# Altium project cmanager.PrjPCB
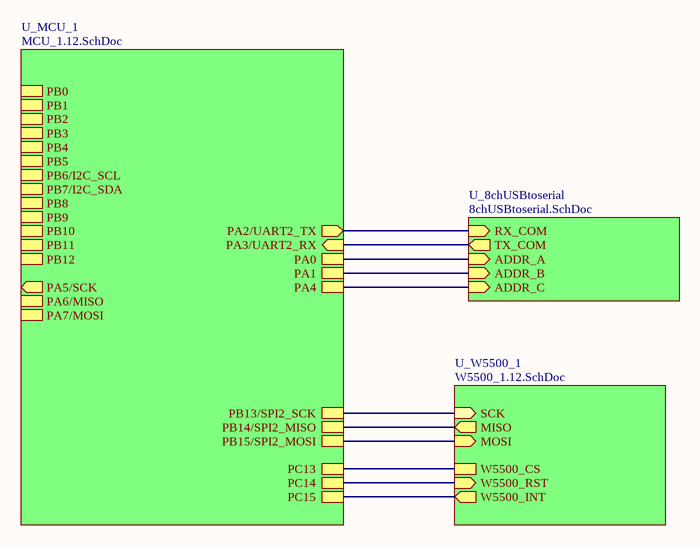
[diagram p0: main.SchDoc]
4 sheets, 114 parts. Net scope: hierarchical (ports join the sheet entries above them; power ports are global).
Board file: PCB1.PcbDoc
Sheets:
  main.SchDoc
    U_8chUSBtoserial = 8chUSBtoserial.SchDoc
    U_MCU_1 = MCU_1.12.SchDoc
    U_W5500_1 = W5500_1.12.SchDoc

## Sheet main.SchDoc
size A4

### Sub-sheets
U_8chUSBtoserial = 8chUSBtoserial.SchDoc: RX_COM (in), ADDR_A (in), ADDR_B (in), ADDR_C (in), TX_COM (out)
U_MCU_1 = MCU_1.12.SchDoc: PA7/MOSI, PA6/MISO, PA5/SCK (out), PB0, PB1, PB2, PB3, PB4, PB5, PB6/I2C_SCL, PB7/I2C_SDA, PB8, PB9, PB10, PB11, PB12, PB13/SPI2_SCK, PB14/SPI2_MISO, PB15/SPI2_MOSI, PA0, PA1, PA4, PC13, PC14, PC15, PA2/UART2_TX (out), PA3/UART2_RX (in)
U_W5500_1 = W5500_1.12.SchDoc: SCK (in), W5500_INT (out), W5500_CS, W5500_RST (in), MOSI (in), MISO (out)

### Nets
PA0: sheet U_8chUSBtoserial/ADDR_A, sheet U_MCU_1/PA0
PA1: sheet U_8chUSBtoserial/ADDR_B, sheet U_MCU_1/PA1
PA2: sheet U_8chUSBtoserial/RX_COM, sheet U_MCU_1/PA2/UART2_TX
PA3: sheet U_8chUSBtoserial/TX_COM, sheet U_MCU_1/PA3/UART2_RX
PA4: sheet U_8chUSBtoserial/ADDR_C, sheet U_MCU_1/PA4
PB13: sheet U_MCU_1/PB13/SPI2_SCK, sheet U_W5500_1/SCK
PB14: sheet U_MCU_1/PB14/SPI2_MISO, sheet U_W5500_1/MISO
PB15: sheet U_MCU_1/PB15/SPI2_MOSI, sheet U_W5500_1/MOSI
PC13: sheet U_MCU_1/PC13, sheet U_W5500_1/W5500_CS
PC14: sheet U_MCU_1/PC14, sheet U_W5500_1/W5500_RST
PC15: sheet U_MCU_1/PC15, sheet U_W5500_1/W5500_INT

## Sheet 8chUSBtoserial.SchDoc
size A3
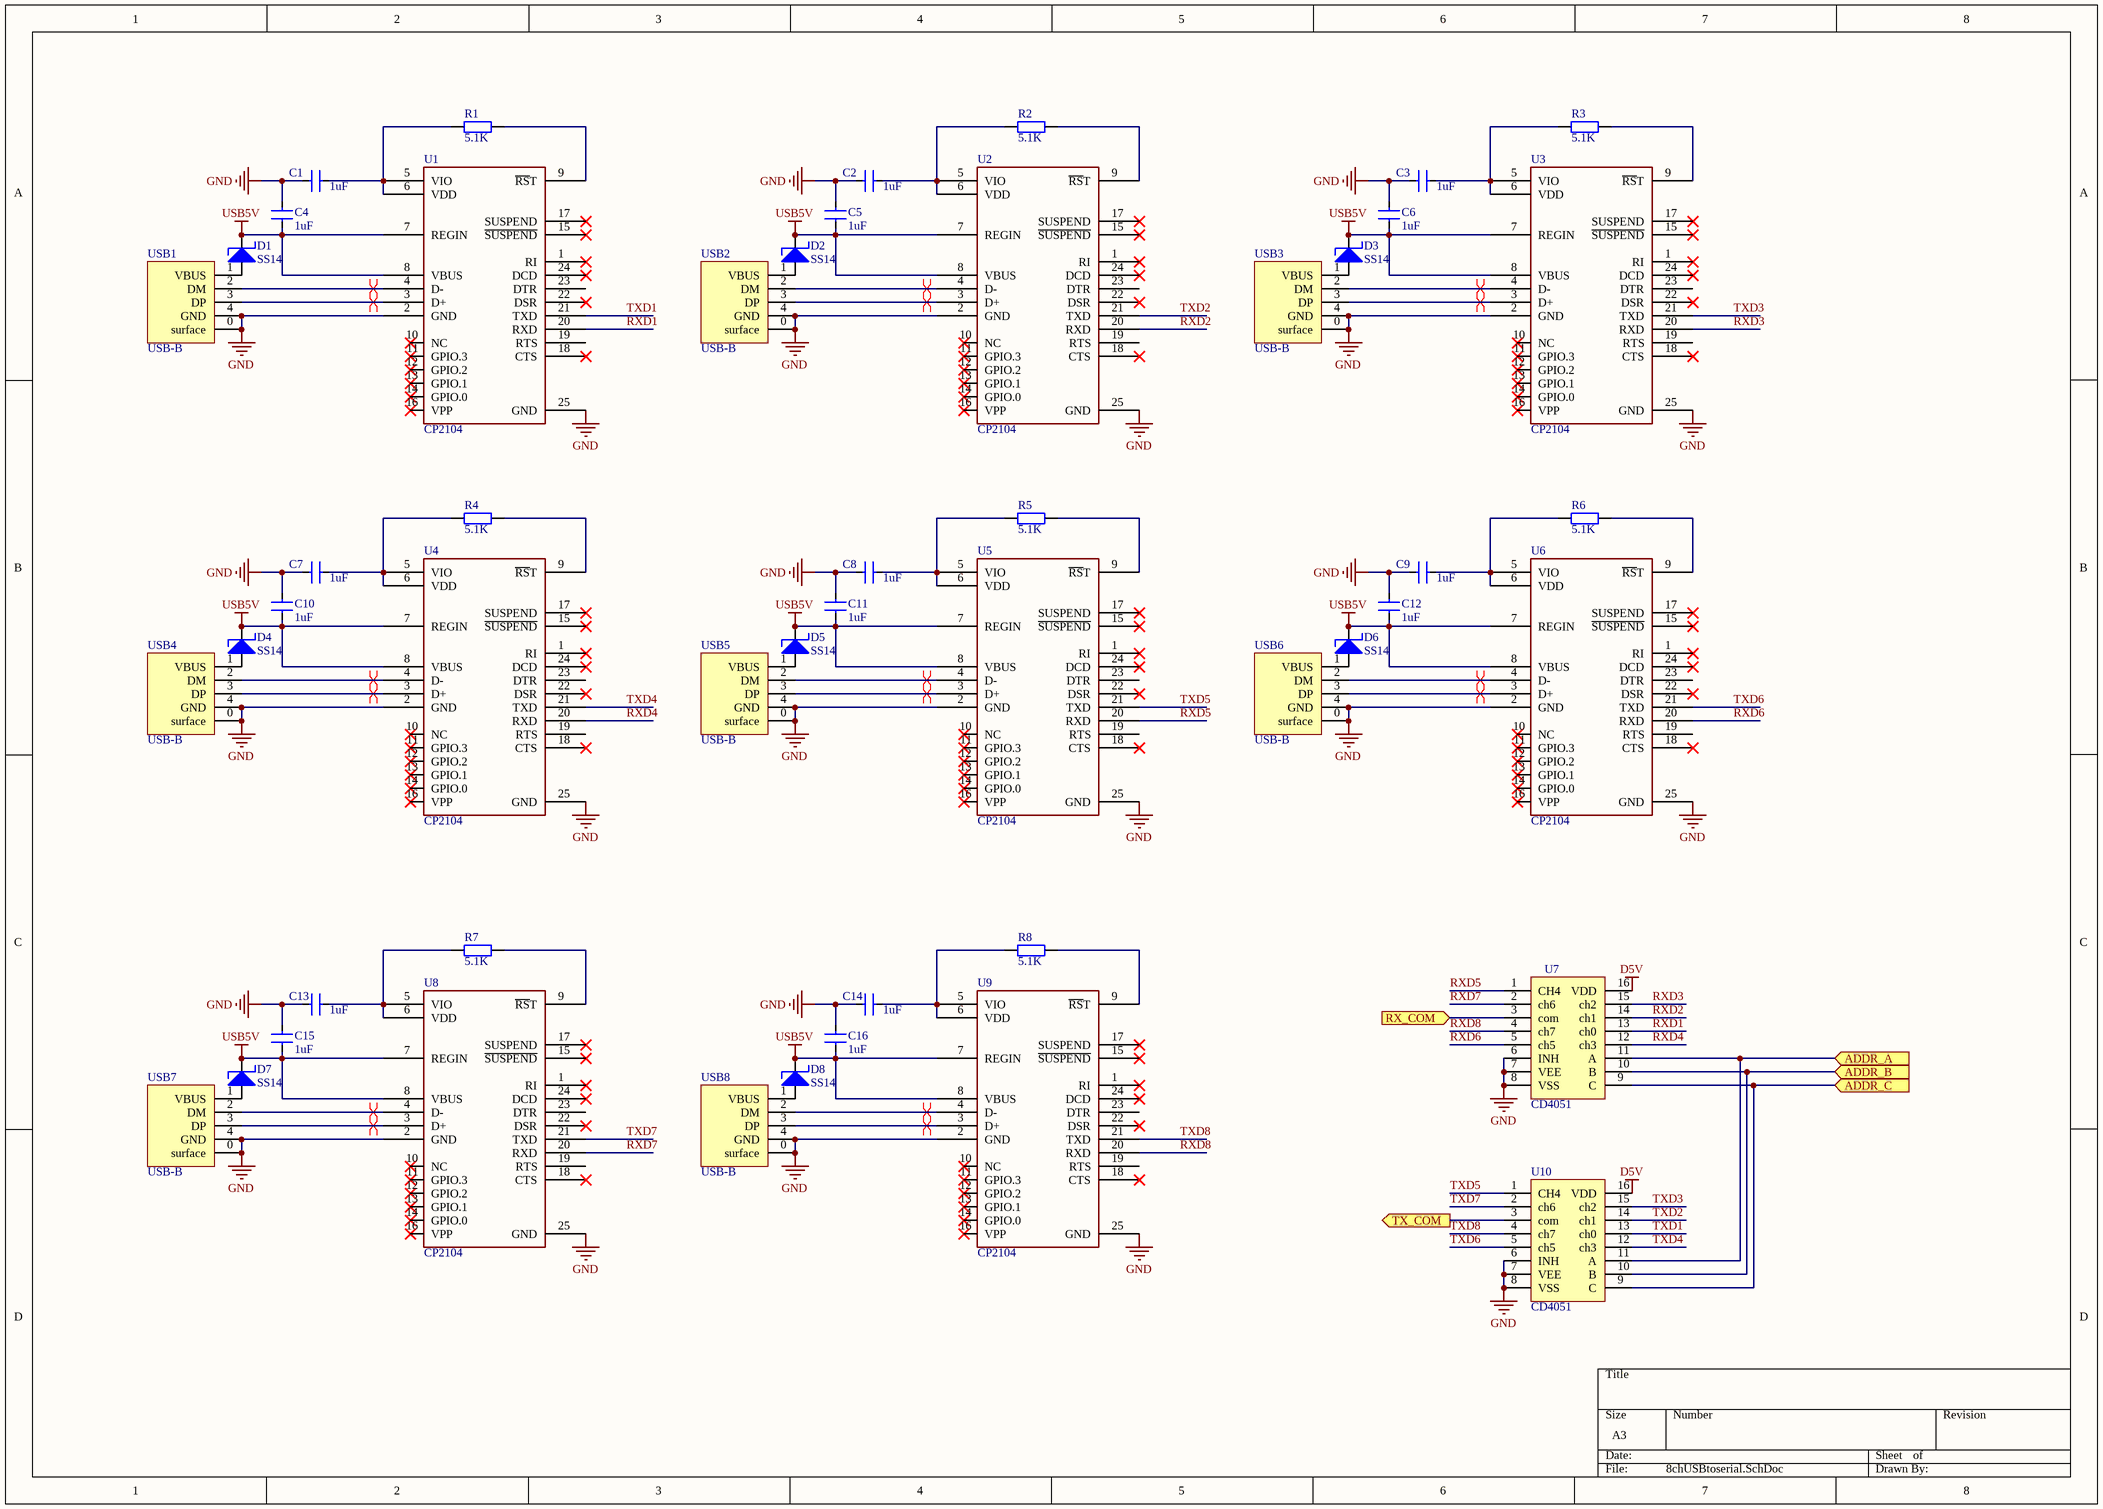
[diagram p1: 8chUSBtoserial.SchDoc]

### Parts
C1  1uF  [0603C]
C2  1uF  [0603C]
C3  1uF  [0603C]
C4  1uF  [0603C]
C5  1uF  [0603C]
C6  1uF  [0603C]
C7  1uF  [0603C]
C8  1uF  [0603C]
C9  1uF  [0603C]
C10  1uF  [0603C]
C11  1uF  [0603C]
C12  1uF  [0603C]
C13  1uF  [0603C]
C14  1uF  [0603C]
C15  1uF  [0603C]
C16  1uF  [0603C]
D1  SS14  [SOD123]
D2  SS14  [SOD123]
D3  SS14  [SOD123]
D4  SS14  [SOD123]
D5  SS14  [SOD123]
D6  SS14  [SOD123]
D7  SS14  [SOD123]
D8  SS14  [SOD123]
R1  5.1K  [0603R]
R2  5.1K  [0603R]
R3  5.1K  [0603R]
R4  5.1K  [0603R]
R5  5.1K  [0603R]
R6  5.1K  [0603R]
R7  5.1K  [0603R]
R8  5.1K  [0603R]
U1  CP2104  [QFN24]
U2  CP2104  [QFN24]
U3  CP2104  [QFN24]
U4  CP2104  [QFN24]
U5  CP2104  [QFN24]
U6  CP2104  [QFN24]
U7  CD4051  [SOP16]
U8  CP2104  [QFN24]
U9  CP2104  [QFN24]
U10  CD4051  [SOP16]
USB1  USB-B  [USB-B]
USB2  USB-B  [USB-B]
USB3  USB-B  [USB-B]
USB4  USB-B  [USB-B]
USB5  USB-B  [USB-B]
USB6  USB-B  [USB-B]
USB7  USB-B  [USB-B]
USB8  USB-B  [USB-B]

### Ports
ADDR_A (in), ADDR_B (in), ADDR_C (in), RX_COM (in), TX_COM (out)

### Nets
D5V: C4.2 C5.2 C6.2 C10.2 C11.2 C12.2 C15.2 C16.2 D1.K D2.K D3.K D4.K D5.K D6.K D7.K D8.K U1.7(REGIN) U1.8(VBUS) U2.7(REGIN) U2.8(VBUS) U3.7(REGIN) U3.8(VBUS) U4.7(REGIN) U4.8(VBUS) U5.7(REGIN) U5.8(VBUS) U6.7(REGIN) U6.8(VBUS) U7.16(VDD) U8.7(REGIN) U8.8(VBUS) U9.7(REGIN) U9.8(VBUS) U10.16(VDD)  [also labelled USB5V]
GND: C1.2 C2.2 C3.2 C4.1 C5.1 C6.1 C7.2 C8.2 C9.2 C10.1 C11.1 C12.1 C13.2 C14.2 C15.1 C16.1 U1.2(GND) U1.25(GND) U2.2(GND) U2.25(GND) U3.2(GND) U3.25(GND) U4.2(GND) U4.25(GND) U5.2(GND) U5.25(GND) U6.2(GND) U6.25(GND) U7.6(INH) U7.7(VEE) U7.8(VSS) U8.2(GND) U8.25(GND) U9.2(GND) U9.25(GND) U10.6(INH) U10.7(VEE) U10.8(VSS) USB1.0(surface) USB1.4(GND) USB2.0(surface) USB2.4(GND) USB3.0(surface) USB3.4(GND) USB4.0(surface) USB4.4(GND) USB5.0(surface) USB5.4(GND) USB6.0(surface) USB6.4(GND) USB7.0(surface) USB7.4(GND) USB8.0(surface) USB8.4(GND)
PA0: U7.11(A) U10.11(A) ; port ADDR_A
PA1: U7.10(B) U10.10(B) ; port ADDR_B
PA2: U7.3(com) ; port RX_COM
PA3: U10.3(com) ; port TX_COM
PA4: U7.9(C) U10.9(C) ; port ADDR_C
RXD1: U1.20(RXD) U7.13(ch0)
RXD2: U2.20(RXD) U7.14(ch1)
RXD3: U3.20(RXD) U7.15(ch2)
RXD4: U4.20(RXD) U7.12(ch3)
RXD5: U5.20(RXD) U7.1(CH4)
RXD6: U6.20(RXD) U7.5(ch5)
RXD7: U7.2(ch6) U8.20(RXD)
RXD8: U7.4(ch7) U9.20(RXD)
TXD1: U1.21(TXD) U10.13(ch0)
TXD2: U2.21(TXD) U10.14(ch1)
TXD3: U3.21(TXD) U10.15(ch2)
TXD4: U4.21(TXD) U10.12(ch3)
TXD5: U5.21(TXD) U10.1(CH4)
TXD6: U6.21(TXD) U10.5(ch5)
TXD7: U8.21(TXD) U10.2(ch6)
TXD8: U9.21(TXD) U10.4(ch7)
NetC1_1: C1.1 R1.1 U1.5(VIO) U1.6(VDD)
NetC2_1: C2.1 R2.1 U2.5(VIO) U2.6(VDD)
NetC3_1: C3.1 R3.1 U3.5(VIO) U3.6(VDD)
NetC7_1: C7.1 R4.1 U4.5(VIO) U4.6(VDD)
NetC8_1: C8.1 R5.1 U5.5(VIO) U5.6(VDD)
NetC9_1: C9.1 R6.1 U6.5(VIO) U6.6(VDD)
NetC13_1: C13.1 R7.1 U8.5(VIO) U8.6(VDD)
NetC14_1: C14.1 R8.1 U9.5(VIO) U9.6(VDD)
NetD1_A: D1.A USB1.1(VBUS)
NetD2_A: D2.A USB2.1(VBUS)
NetD3_A: D3.A USB3.1(VBUS)
NetD4_A: D4.A USB4.1(VBUS)
NetD5_A: D5.A USB5.1(VBUS)
NetD6_A: D6.A USB6.1(VBUS)
NetD7_A: D7.A USB7.1(VBUS)
NetD8_A: D8.A USB8.1(VBUS)
NetR1_2: R1.2 U1.9(~{RS}T)
NetR2_2: R2.2 U2.9(~{RS}T)
NetR3_2: R3.2 U3.9(~{RS}T)
NetR4_2: R4.2 U4.9(~{RS}T)
NetR5_2: R5.2 U5.9(~{RS}T)
NetR6_2: R6.2 U6.9(~{RS}T)
NetR7_2: R7.2 U8.9(~{RS}T)
NetR8_2: R8.2 U9.9(~{RS}T)
NetU1_3: U1.3(D+) USB1.3(DP)
NetU1_4: U1.4(D-) USB1.2(DM)
NetU2_3: U2.3(D+) USB2.3(DP)
NetU2_4: U2.4(D-) USB2.2(DM)
NetU3_3: U3.3(D+) USB3.3(DP)
NetU3_4: U3.4(D-) USB3.2(DM)
NetU4_3: U4.3(D+) USB4.3(DP)
NetU4_4: U4.4(D-) USB4.2(DM)
NetU5_3: U5.3(D+) USB5.3(DP)
NetU5_4: U5.4(D-) USB5.2(DM)
NetU6_3: U6.3(D+) USB6.3(DP)
NetU6_4: U6.4(D-) USB6.2(DM)
NetU8_3: U8.3(D+) USB7.3(DP)
NetU8_4: U8.4(D-) USB7.2(DM)
NetU9_3: U9.3(D+) USB8.3(DP)
NetU9_4: U9.4(D-) USB8.2(DM)

Not connected (* = marked no-connect by the designer): U1 1(RI)* 10(NC)* 11(GPIO.3)* 12(GPIO.2)* 13(GPIO.1)* 14(GPIO.0)* 15(~{SUSPEND})* 16(VPP)* 17(SUSPEND)* 18(CTS)* 19(RTS) 22(DSR)* 23(DTR) 24(DCD)*; U2 1(RI)* 10(NC)* 11(GPIO.3)* 12(GPIO.2)* 13(GPIO.1)* 14(GPIO.0)* 15(~{SUSPEND})* 16(VPP)* 17(SUSPEND)* 18(CTS)* 19(RTS) 22(DSR)* 23(DTR) 24(DCD)*; U3 1(RI)* 10(NC)* 11(GPIO.3)* 12(GPIO.2)* 13(GPIO.1)* 14(GPIO.0)* 15(~{SUSPEND})* 16(VPP)* 17(SUSPEND)* 18(CTS)* 19(RTS) 22(DSR)* 23(DTR) 24(DCD)*; U4 1(RI)* 10(NC)* 11(GPIO.3)* 12(GPIO.2)* 13(GPIO.1)* 14(GPIO.0)* 15(~{SUSPEND})* 16(VPP)* 17(SUSPEND)* 18(CTS)* 19(RTS) 22(DSR)* 23(DTR) 24(DCD)*; U5 1(RI)* 10(NC)* 11(GPIO.3)* 12(GPIO.2)* 13(GPIO.1)* 14(GPIO.0)* 15(~{SUSPEND})* 16(VPP)* 17(SUSPEND)* 18(CTS)* 19(RTS) 22(DSR)* 23(DTR) 24(DCD)*; U6 1(RI)* 10(NC)* 11(GPIO.3)* 12(GPIO.2)* 13(GPIO.1)* 14(GPIO.0)* 15(~{SUSPEND})* 16(VPP)* 17(SUSPEND)* 18(CTS)* 19(RTS) 22(DSR)* 23(DTR) 24(DCD)*; U8 1(RI)* 10(NC)* 11(GPIO.3)* 12(GPIO.2)* 13(GPIO.1)* 14(GPIO.0)* 15(~{SUSPEND})* 16(VPP)* 17(SUSPEND)* 18(CTS)* 19(RTS) 22(DSR)* 23(DTR) 24(DCD)*; U9 1(RI)* 10(NC)* 11(GPIO.3)* 12(GPIO.2)* 13(GPIO.1)* 14(GPIO.0)* 15(~{SUSPEND})* 16(VPP)* 17(SUSPEND)* 18(CTS)* 19(RTS) 22(DSR)* 23(DTR) 24(DCD)*

### Layout directives
differential pair: NetU1_3, NetU1_4, NetU2_3, NetU2_4, NetU3_3, NetU3_4, NetU4_3, NetU4_4, NetU5_3, NetU5_4, NetU6_3, NetU6_4, NetU8_3, NetU8_4, NetU9_3, NetU9_4

### Library data of the parts
C1-C16 = CAP: 普通小电容
D1-D8 = D-S: 肖特基二极管
R1-R8 = RES: 普通电阻
U7 U10 = CD4051: 模拟多路复用器
USB1-USB8 = USB-B: USB 1.1, Right Angle, SMT, A Type, Plug, 4 Position, Natural; ContactMaterial: Brass; ContactPlating: Gold (30) over Nickel (50); PCB_Layout: Complies with manufacturer's recommendation.; DrillSize: Corresponds to nominal value.; PanelGround: Without; Published: 15-Jul-2004; DatasheetDocument: 21-Jan-2003; PackageDocument: 21-Jan-2003; PackageReference: 1470695A; Publisher: Altium Limited; HousingMaterial: Thermoplastic; ComponentLink1Description: Manufacturer Link; ComponentLink1URL: http://www.tycoelectronics.com/; ComponentLink2Description: Packaging Specification; ComponentLink2URL: http://ecommas.tycoelectronics.com/commerce/DocumentDelivery/DDEController?Action=showdoc&DocId=Customer+Drawing%7F1470695%7FO%7Fpdf%7FEnglish%7FC_1470695_O.pdf

## Sheet MCU_1.12.SchDoc
size A4
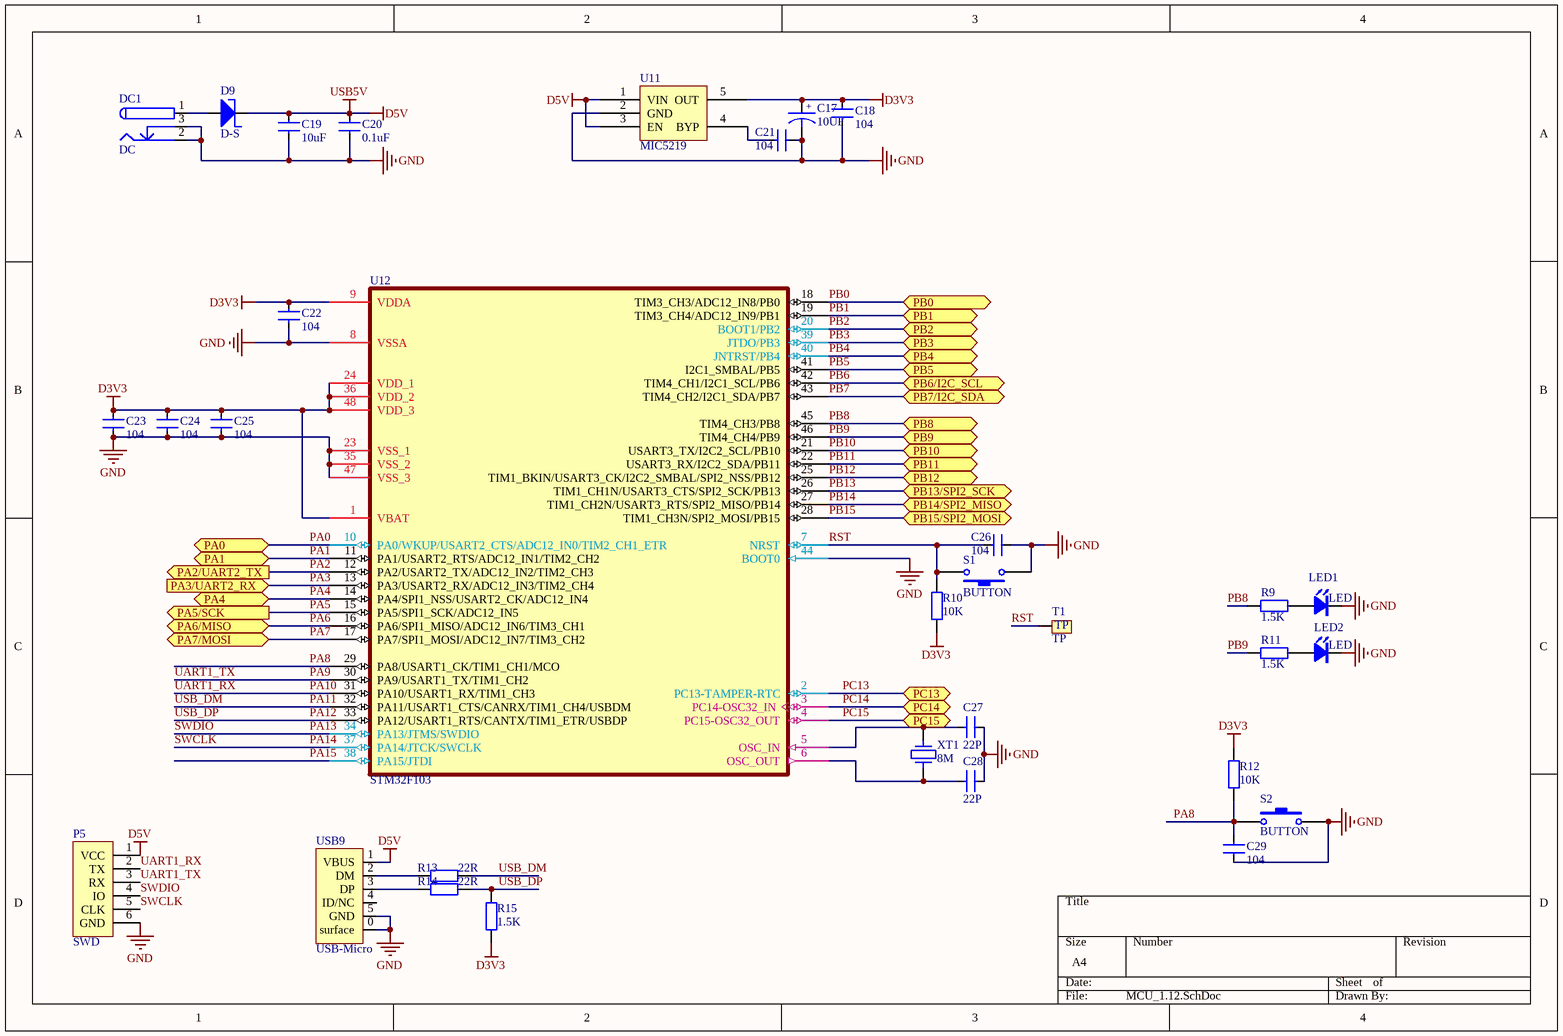
[diagram p2: MCU_1.12.SchDoc]

### Parts
C17  10UF  [3216C]
C18  104  [0603C]
C19  10uF  [0805C]
C20  0.1uF  [0402C]
C21  104  [0603C]
C22  104  [0603C]
C23  104  [0603C]
C24  104  [0603C]
C25  104  [0603C]
C26  104  [0603C]
C27  22P  [0603C]
C28  22P  [0603C]
C29  104  [0603C]
D9  D-S  [SOD123]
DC1  DC  [DC005]
LED1  LED  [0805D]
LED2  LED  [0805D]
P5  SWD  [HDR1X6]
R9  1.5K  [0603R]
R10  10K  [0603R]
R11  1.5K  [0603R]
R12  10K  [0603R]
R13  22R  [0603R]
R14  22R  [0603R]
R15  1.5K  [0603R]
S1  BUTTON  [SW-3X4X2]
S2  BUTTON  [SW-3X4X2]
T1  TP  [TP1]
U11  MIC5219  [SOT23-5]
U12  STM32F103  [LQFP48]
USB9  USB-Micro  [USB-Micro-2]
XT1  8M  [5032]

### Ports
PA0, PA1, PA2/UART2_TX (out), PA3/UART2_RX (in), PA4, PA5/SCK (out), PA6/MISO, PA7/MOSI, PB0, PB1, PB2, PB3, PB4, PB5, PB6/I2C_SCL, PB7/I2C_SDA, PB8, PB9, PB10, PB11, PB12, PB13/SPI2_SCK, PB14/SPI2_MISO, PB15/SPI2_MOSI, PC13, PC14, PC15

### Nets
D3V3: C17.1 C18.2 C22.2 C23.2 C24.1 C25.2 R10.1 R12.1 R15.2 U11.5(OUT) U12.1(VBAT) U12.9(VDDA) U12.24(VDD_1) U12.36(VDD_2) U12.48(VDD_3)
D5V: C19.1 C20.1 D9.K P5.1(VCC) U11.1(VIN) U11.3(EN) USB9.1(VBUS)  [also labelled USB5V]
GND: C17.2 C18.1 C19.2 C20.2 C21.2 C22.1 C23.1 C24.2 C25.1 C26.2 C27.2 C28.2 C29.1 DC1.2 DC1.3 LED1.K LED2.K P5.6(GND) S1.1 S2.2 U11.2(GND) U12.8(VSSA) U12.23(VSS_1) U12.35(VSS_2) U12.44(BOOT0) U12.47(VSS_3) USB9.0(surface) USB9.5(GND)
PA0: U12.10(PA0/WKUP/USART2_CTS/ADC12_IN0/TIM2_CH1_ETR) ; port PA0
PA1: U12.11(PA1/USART2_RTS/ADC12_IN1/TIM2_CH2) ; port PA1
PA2: U12.12(PA2/USART2_TX/ADC12_IN2/TIM2_CH3) ; port PA2/UART2_TX
PA3: U12.13(PA3/USART2_RX/ADC12_IN3/TIM2_CH4) ; port PA3/UART2_RX
PA4: U12.14(PA4/SPI1_NSS/USART2_CK/ADC12_IN4) ; port PA4
PA5: U12.15(PA5/SPI1_SCK/ADC12_IN5) ; port PA5/SCK
PA6: U12.16(PA6/SPI1_MISO/ADC12_IN6/TIM3_CH1) ; port PA6/MISO
PA7: U12.17(PA7/SPI1_MOSI/ADC12_IN7/TIM3_CH2) ; port PA7/MOSI
PA8: C29.2 R12.2 S2.1 U12.29(PA8/USART1_CK/TIM1_CH1/MCO)
PA9: P5.3(RX) U12.30(PA9/USART1_TX/TIM1_CH2)  [also labelled UART1_TX]
PA10: P5.2(TX) U12.31(PA10/USART1_RX/TIM1_CH3)  [also labelled UART1_RX]
PA11: R13.1 U12.32(PA11/USART1_CTS/CANRX/TIM1_CH4/USBDM)  [also labelled USB_DM]
PA12: R14.1 R15.1 U12.33(PA12/USART1_RTS/CANTX/TIM1_ETR/USBDP)  [also labelled USB_DP]
PA13: P5.4(IO) U12.34(PA13/JTMS/SWDIO)  [also labelled SWDIO]
PA14: P5.5(CLK) U12.37(PA14/JTCK/SWCLK)  [also labelled SWCLK]
PA15: U12.38(PA15/JTDI)
PB0: U12.18(TIM3_CH3/ADC12_IN8/PB0) ; port PB0
PB1: U12.19(TIM3_CH4/ADC12_IN9/PB1) ; port PB1
PB2: U12.20(BOOT1/PB2) ; port PB2
PB3: U12.39(JTDO/PB3) ; port PB3
PB4: U12.40(JNTRST/PB4) ; port PB4
PB5: U12.41(I2C1_SMBAL/PB5) ; port PB5
PB6: U12.42(TIM4_CH1/I2C1_SCL/PB6) ; port PB6/I2C_SCL
PB7: U12.43(TIM4_CH2/I2C1_SDA/PB7) ; port PB7/I2C_SDA
PB8: R9.1 U12.45(TIM4_CH3/PB8) ; port PB8
PB9: R11.1 U12.46(TIM4_CH4/PB9) ; port PB9
PB10: U12.21(USART3_TX/I2C2_SCL/PB10) ; port PB10
PB11: U12.22(USART3_RX/I2C2_SDA/PB11) ; port PB11
PB12: U12.25(TIM1_BKIN/USART3_CK/I2C2_SMBAL/SPI2_NSS/PB12) ; port PB12
PB13: U12.26(TIM1_CH1N/USART3_CTS/SPI2_SCK/PB13) ; port PB13/SPI2_SCK
PB14: U12.27(TIM1_CH2N/USART3_RTS/SPI2_MISO/PB14) ; port PB14/SPI2_MISO
PB15: U12.28(TIM1_CH3N/SPI2_MOSI/PB15) ; port PB15/SPI2_MOSI
PC13: U12.2(PC13-TAMPER-RTC) ; port PC13
PC14: U12.3(PC14-OSC32_IN) ; port PC14
PC15: U12.4(PC15-OSC32_OUT) ; port PC15
RST: C26.1 R10.2 S1.2 T1.1 U12.7(NRST)
NetC21_1: C21.1 U11.4(BYP)
NetC27_1: C27.1 U12.5(OSC_IN) XT1.1
NetC28_1: C28.1 U12.6(OSC_OUT) XT1.2
NetD9_A: D9.A DC1.1
NetLED1_A: LED1.A R9.2
NetLED2_A: LED2.A R11.2
NetR13_2: R13.2 USB9.2(DM)
NetR14_2: R14.2 USB9.3(DP)

Not connected (* = marked no-connect by the designer): USB9 4(ID/NC)

### Notes on the sheet
- Labels drawn without touching a wire or pin: ENC1, ENC2, ENC3
- (in symbol CAP-T) +

### Library data of the parts
C17 = CAP-T: 钽电容
C18 C21-C29 = CAP: 普通小电容
C19 C20 = CAP: 普通小电容; 电压: 50V
D9 = D-S: 肖特基二极管
DC1 = DC00X: 圆形电源接口
P5 = SWD: 单片机端
R9-R15 = RES: 普通电阻
T1 = TP: testpoint
USB9 = USB-Micro: USB 1.1, Right Angle, SMT, A Type, Plug, 4 Position, Natural; ContactMaterial: Brass; ContactPlating: Gold (30) over Nickel (50); PCB_Layout: Complies with manufacturer's recommendation.; DrillSize: Corresponds to nominal value.; PanelGround: Without; Published: 15-Jul-2004; DatasheetDocument: 21-Jan-2003; PackageDocument: 21-Jan-2003; PackageReference: 1470695A; Publisher: Altium Limited; HousingMaterial: Thermoplastic; ComponentLink1Description: Manufacturer Link; ComponentLink1URL: http://www.tycoelectronics.com/; ComponentLink2Description: Packaging Specification; ComponentLink2URL: http://ecommas.tycoelectronics.com/commerce/DocumentDelivery/DDEController?Action=showdoc&DocId=Customer+Drawing%7F1470695%7FO%7Fpdf%7FEnglish%7FC_1470695_O.pdf
XT1 = XT: 晶振

## Sheet W5500_1.12.SchDoc
size A4
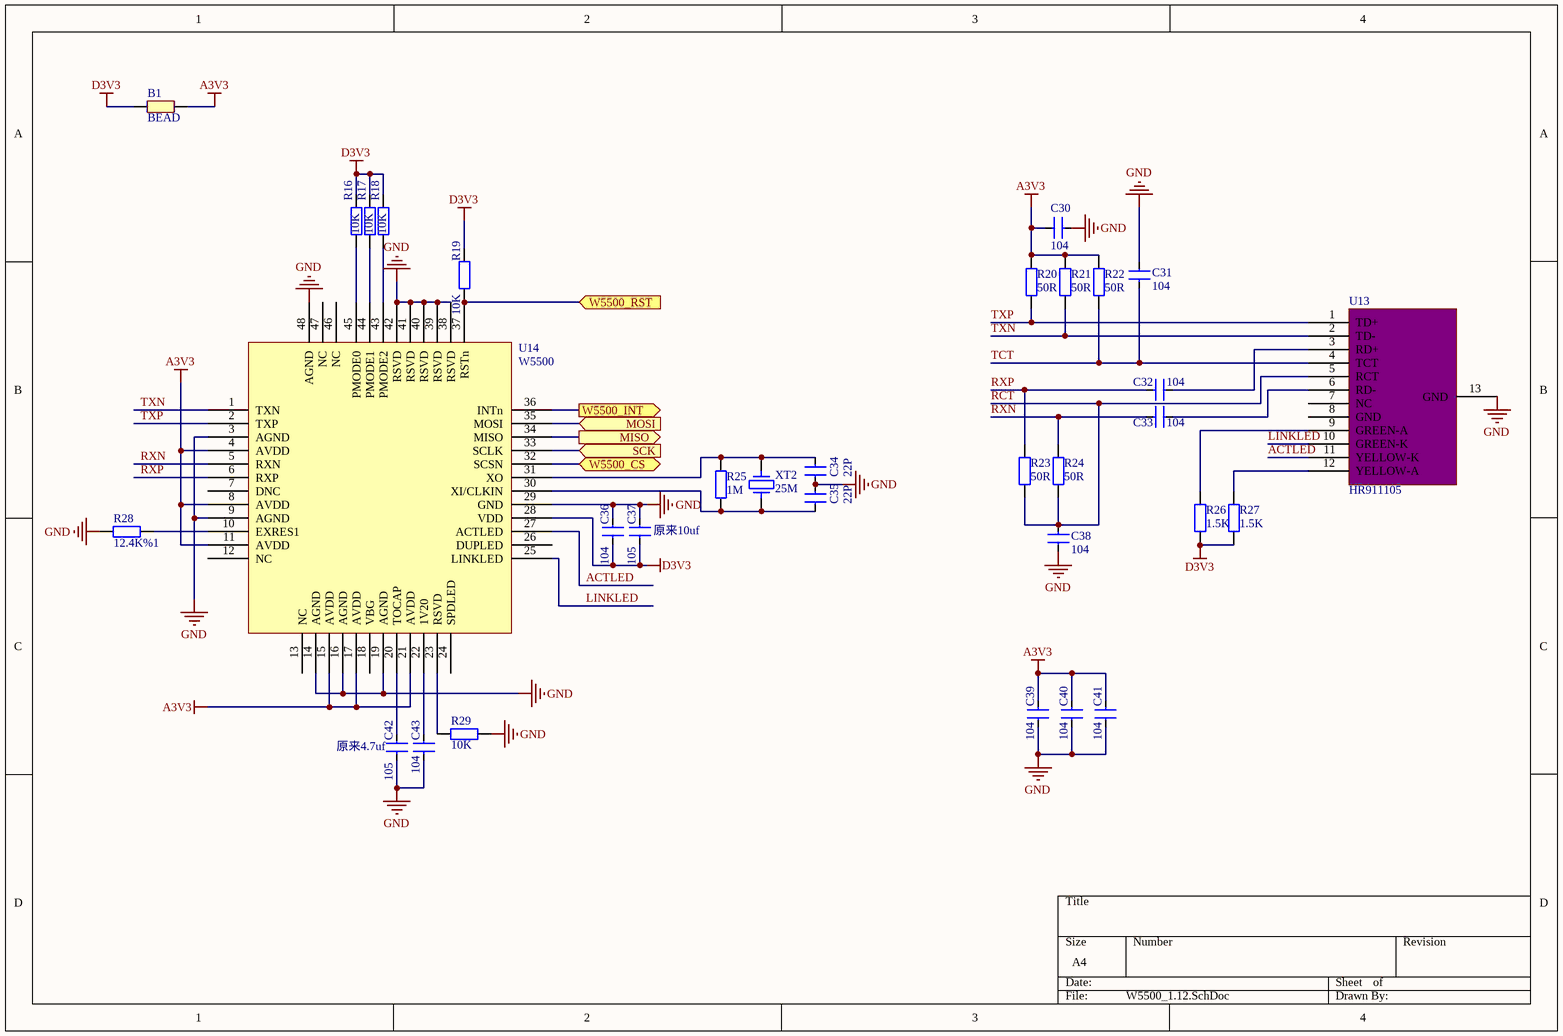
[diagram p3: W5500_1.12.SchDoc]

### Parts
B1  BEAD  [0603L]
C30  104  [0603C]
C31  104  [0603C]
C32  104  [0603C]
C33  104  [0603C]
C34  22P  [0603C]
C35  22P  [0603C]
C36  104  [0603C]
C37  105  [0603C]
C38  104  [0603C]
C39  104  [0603C]
C40  104  [0603C]
C41  104  [0603C]
C42  105  [0603C]
C43  104  [0603C]
R16  10K  [0603R]
R17  10K  [0603R]
R18  10K  [0603R]
R19  10K  [0603R]
R20  50R  [0603R]
R21  50R  [0603R]
R22  50R  [0603R]
R23  50R  [0603R]
R24  50R  [0603R]
R25  1M  [0603R]
R26  1.5K  [0603R]
R27  1.5K  [0603R]
R28  12.4K%1  [0603R]
R29  10K  [0603R]
U13  HR911105  [HR911105A]
U14  W5500  [LQFP48]
XT2  25M  [5032]

### Ports
MISO (out), MOSI (in), SCK (in), W5500_CS, W5500_INT (out), W5500_RST (in)

### Nets
A3V3: B1.2 C30.1 C39.2 C40.2 C41.2 R20.2 R21.2 R22.2 U14.4(AVDD) U14.8(AVDD) U14.11(AVDD) U14.15(AVDD) U14.17(AVDD) U14.21(AVDD)
D3V3: B1.1 C36.1 C37.1 R16.2 R17.2 R18.2 R19.2 R26.1 R27.1 U14.28(VDD)
GND: C30.2 C31.1 C34.1 C35.2 C36.2 C37.2 C38.2 C39.1 C40.1 C41.1 C42.1 C43.1 R28.2 R29.1 U13.13(GND) U14.3(AGND) U14.9(AGND) U14.14(AGND) U14.16(AGND) U14.19(AGND) U14.29(GND) U14.38(RSVD) U14.39(RSVD) U14.40(RSVD) U14.41(RSVD) U14.42(RSVD) U14.48(AGND)
ACTLED: U13.11(YELLOW-K) U14.27(ACTLED)
LINKLED: U13.10(GREEN-K) U14.25(LINKLED)
PB13: U14.33(SCLK) ; port SCK
PB14: U14.34(MISO) ; port MISO
PB15: U14.35(MOSI) ; port MOSI
PC13: U14.32(SCSN) ; port W5500_CS
PC14: R19.1 U14.37(RSTn) ; port W5500_RST
PC15: U14.36(INTn) ; port W5500_INT
RCT: C38.1 R23.2 R24.2 U13.5(RCT)
RXN: C33.2 R24.1 U14.5(RXN)
RXP: C32.2 R23.1 U14.6(RXP)
TCT: C31.2 R22.1 U13.4(TCT)
TXN: R21.1 U13.2(TD-) U14.1(TXN)
TXP: R20.1 U13.1(TD+) U14.2(TXP)
NetC32_1: C32.1 U13.3(RD+)
NetC33_1: C33.1 U13.6(RD-)
NetC34_2: C34.2 R25.2 U14.31(XO) XT2.2
NetC35_1: C35.1 R25.1 U14.30(XI/CLKIN) XT2.1
NetC42_2: C42.2 U14.20(TOCAP)
NetC43_2: C43.2 U14.22(1V20)
NetR16_1: R16.1 U14.45(PMODE0)
NetR17_1: R17.1 U14.44(PMODE1)
NetR18_1: R18.1 U14.43(PMODE2)
NetR26_2: R26.2 U13.9(GREEN-A)
NetR27_2: R27.2 U13.12(YELLOW-A)
NetR28_1: R28.1 U14.10(EXRES1)
NetR29_2: R29.2 U14.23(RSVD)

Not connected (* = marked no-connect by the designer): U13 7(NC) 8(GND); U14 7(DNC) 12(NC) 13(NC) 18(VBG) 24(SPDLED) 26(DUPLED) 46(NC) 47(NC)

### Notes on the sheet
- (near C37) 原来10uf
- (near C42) 原来4.7uf

### Library data of the parts
B1 = BEAD: 磁珠
C30-C43 = CAP: 普通小电容
R16-R29 = RES: 普通电阻
XT2 = XT: 晶振

## Nets that join several sheets
D3V3: MCU_1.12 (15 pins), W5500_1.12 (10 pins)
D5V: 8chUSBtoserial (34 pins), MCU_1.12 (7 pins)
GND: 8chUSBtoserial (54 pins), MCU_1.12 (28 pins), W5500_1.12 (27 pins)
PA0: 8chUSBtoserial (U7.11 U10.11), MCU_1.12 (U12.10)
PA1: 8chUSBtoserial (U7.10 U10.10), MCU_1.12 (U12.11)
PA2: 8chUSBtoserial (U7.3), MCU_1.12 (U12.12)
PA3: 8chUSBtoserial (U10.3), MCU_1.12 (U12.13)
PA4: 8chUSBtoserial (U7.9 U10.9), MCU_1.12 (U12.14)
PB13: MCU_1.12 (U12.26), W5500_1.12 (U14.33)
PB14: MCU_1.12 (U12.27), W5500_1.12 (U14.34)
PB15: MCU_1.12 (U12.28), W5500_1.12 (U14.35)
PC13: MCU_1.12 (U12.2), W5500_1.12 (U14.32)
PC14: MCU_1.12 (U12.3), W5500_1.12 (R19.1 U14.37)
PC15: MCU_1.12 (U12.4), W5500_1.12 (U14.36)